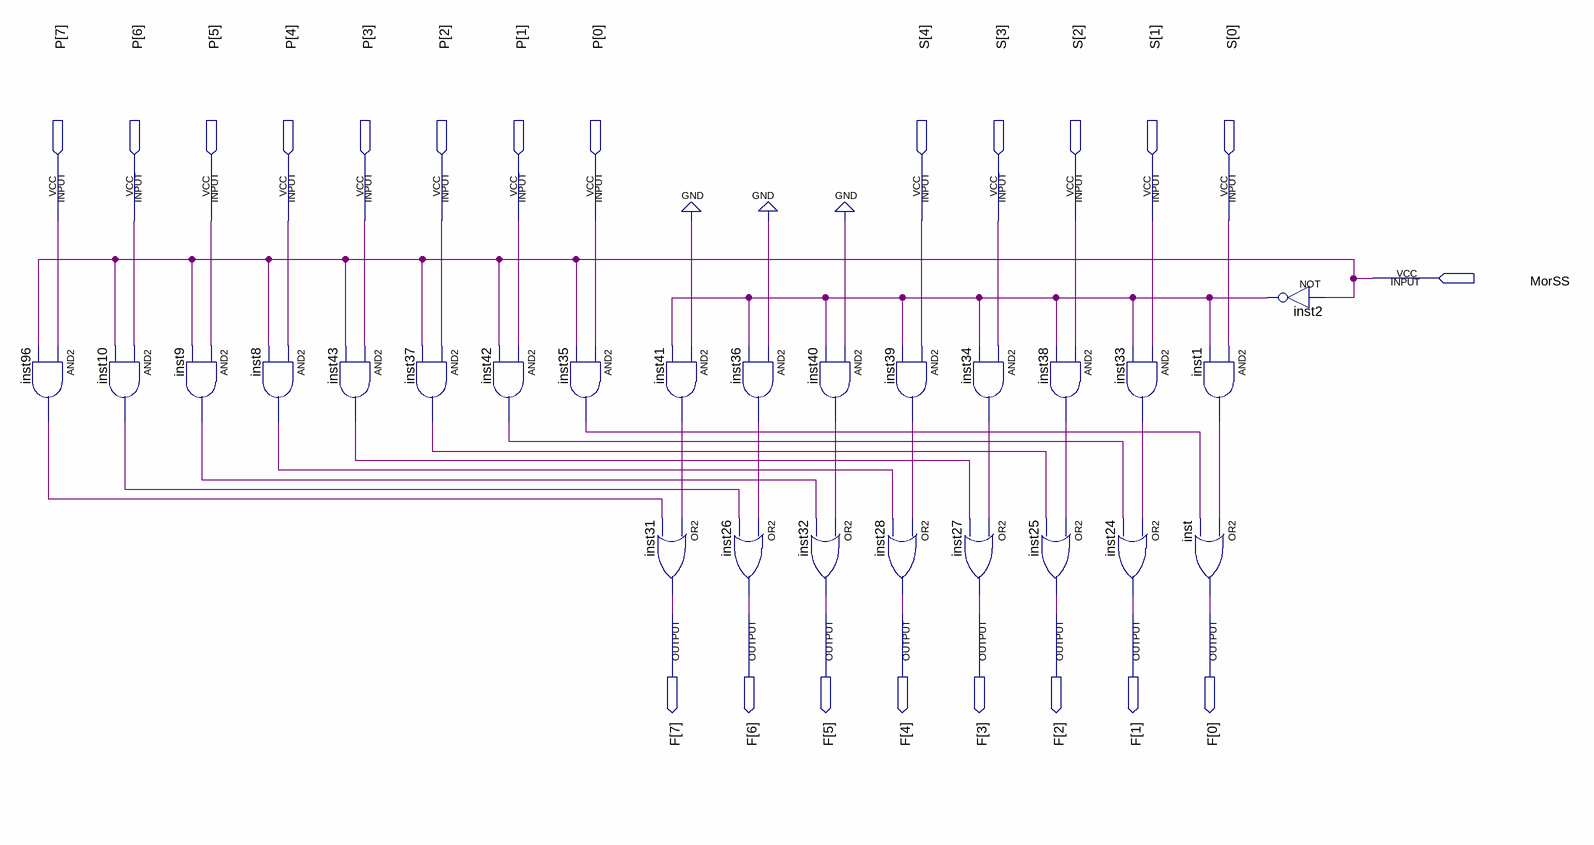
[diagram p0: schematic sheet]
// Quartus schematic MUX27_7.bdf as structural Verilog: 25 symbols, 22 pins
module MUX27_7 (
  input  [7:0] P,
  input  [4:0] S,
  input  MorSS,
  output [7:0] F
);

  wire inst1_out, inst2_out, inst8_out, inst9_out, inst10_out, inst33_out, inst34_out, inst35_out,
       inst36_out, inst37_out, inst38_out, inst39_out, inst40_out, inst41_out, inst42_out, inst43_out,
       inst96_out;

  and inst96 (inst96_out, P[7], MorSS);
  and inst10 (inst10_out, P[6], MorSS);
  and inst9 (inst9_out, P[5], MorSS);
  and inst8 (inst8_out, P[4], MorSS);
  and inst43 (inst43_out, P[3], MorSS);
  and inst37 (inst37_out, P[2], MorSS);
  and inst42 (inst42_out, P[1], MorSS);
  and inst35 (inst35_out, P[0], MorSS);
  and inst41 (inst41_out, 1'b0, inst2_out);
  or inst31 (F[7], inst41_out, inst96_out);
  and inst36 (inst36_out, 1'b0, inst2_out);
  or inst26 (F[6], inst36_out, inst10_out);
  and inst40 (inst40_out, 1'b0, inst2_out);
  or inst32 (F[5], inst40_out, inst9_out);
  and inst39 (inst39_out, S[4], inst2_out);
  or inst28 (F[4], inst39_out, inst8_out);
  and inst34 (inst34_out, S[3], inst2_out);
  or inst27 (F[3], inst34_out, inst43_out);
  and inst38 (inst38_out, S[2], inst2_out);
  or inst25 (F[2], inst38_out, inst37_out);
  and inst33 (inst33_out, S[1], inst2_out);
  or inst24 (F[1], inst33_out, inst42_out);
  and inst1 (inst1_out, S[0], inst2_out);
  or inst (F[0], inst1_out, inst35_out);
  not inst2 (inst2_out, MorSS);
endmodule
